# Altium project Capteur_Couleur.PrjPcb
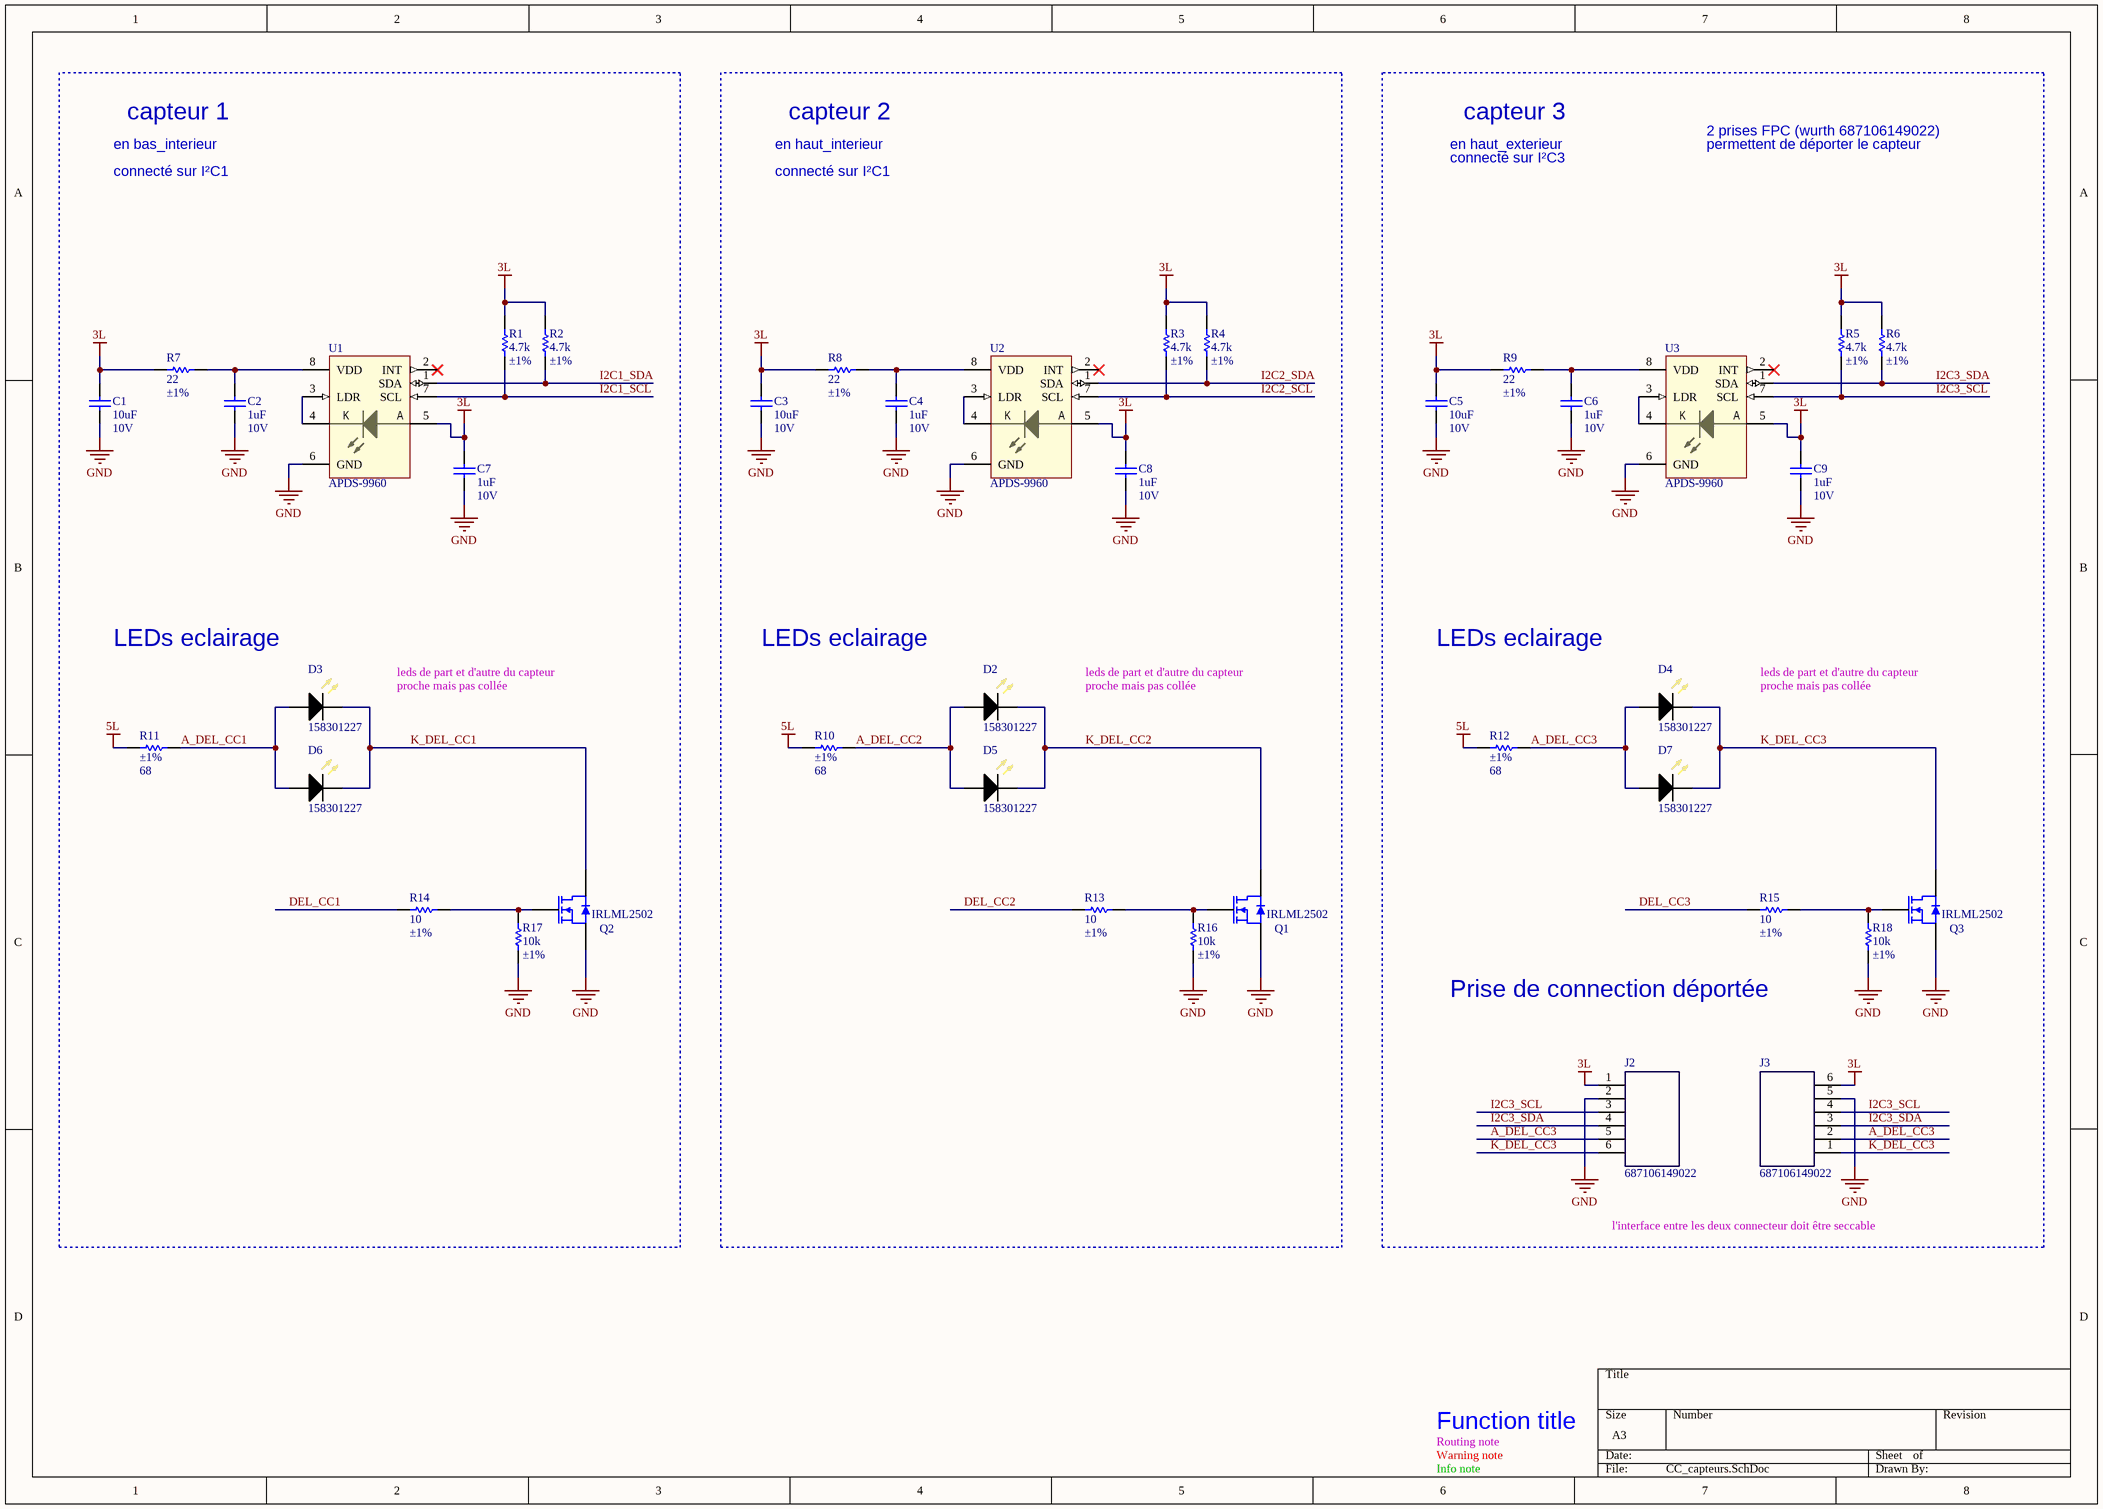
[diagram p0: CC_capteurs.SchDoc]
4 sheets, 89 parts. Net scope: global (net labels, ports and power ports of the same name join across sheets).
Board file: Capteur_Couleur.PcbDoc
Sheets:
  CC_capteurs.SchDoc
  Revision.SchDoc
  CC_pwr-moteur.SchDoc
  CC_microcontroleur.SchDoc

## Sheet CC_capteurs.SchDoc
size A3; Author: Audran; CompanyName: Goldorak; Address1: Electrolab; Address2: 52 rue Paul Lescop; Address3: 92000 Nanterre; ProjectName: Cartes_2017

### Parts
C1  10uF  RatedVoltage: 10V  [WCAP-CSGP_0805, 2x1.25x1.25]
C2  1uF  RatedVoltage: 10V  [WCAP-CSGP_0402, 1x0.5x0.5]
C3  10uF  RatedVoltage: 10V  [WCAP-CSGP_0805, 2x1.25x1.25]
C4  1uF  RatedVoltage: 10V  [WCAP-CSGP_0402, 1x0.5x0.5]
C5  10uF  RatedVoltage: 10V  [WCAP-CSGP_0805, 2x1.25x1.25]
C6  1uF  RatedVoltage: 10V  [WCAP-CSGP_0402, 1x0.5x0.5]
C7  1uF  RatedVoltage: 10V  [WCAP-CSGP_0402, 1x0.5x0.5]
C8  1uF  RatedVoltage: 10V  [WCAP-CSGP_0402, 1x0.5x0.5]
C9  1uF  RatedVoltage: 10V  [WCAP-CSGP_0402, 1x0.5x0.5]
D2  158301227  [WL-SWTP_3014]
D3  158301227  [WL-SWTP_3014]
D4  158301227  [WL-SWTP_3014]
D5  158301227  [WL-SWTP_3014]
D6  158301227  [WL-SWTP_3014]
D7  158301227  [WL-SWTP_3014]
J2  687106149022  [687106149022]
J3  687106149022  [687106149022]
Q1  IRLML2502  [SOT-23]
Q2  IRLML2502  [SOT-23]
Q3  IRLML2502  [SOT-23]
R1  value 4.7k  Precision: ±1%  [RESC1005X04N]
R2  value 4.7k  Precision: ±1%  [RESC1005X04N]
R3  value 4.7k  Precision: ±1%  [RESC1005X04N]
R4  value 4.7k  Precision: ±1%  [RESC1005X04N]
R5  value 4.7k  Precision: ±1%  [RESC1005X04N]
R6  value 4.7k  Precision: ±1%  [RESC1005X04N]
R7  value 22  Precision: ±1%  [RESC1005X04N]
R8  value 22  Precision: ±1%  [RESC1005X04N]
R9  value 22  Precision: ±1%  [RESC1005X04N]
R10  value 68  Precision: ±1%  [RESC1608X06N]  (hidden comment: RC0603FR-0768RL)
R11  value 68  Precision: ±1%  [RESC1608X06N]  (hidden comment: RC0603FR-0768RL)
R12  value 68  Precision: ±1%  [RESC1608X06N]  (hidden comment: RC0603FR-0768RL)
R13  value 10  Precision: ±1%  [RESC1005X04N]  (hidden comment: RC0402FR-0710RL)
R14  value 10  Precision: ±1%  [RESC1005X04N]  (hidden comment: RC0402FR-0710RL)
R15  value 10  Precision: ±1%  [RESC1005X04N]  (hidden comment: RC0402FR-0710RL)
R16  value 10k  Precision: ±1%  [RESC1005X04N]  (hidden comment: RC0402FR-0710KL)
R17  value 10k  Precision: ±1%  [RESC1005X04N]  (hidden comment: RC0402FR-0710KL)
R18  value 10k  Precision: ±1%  [RESC1005X04N]  (hidden comment: RC0402FR-0710KL)
U1  APDS-9960  [APDS996X]
U2  APDS-9960  [APDS996X]
U3  APDS-9960  [APDS996X]

### Nets
3L: C1.2 C3.2 C5.2 C7.2 C8.2 C9.2 J2.1 J3.6 R1.1 R2.1 R3.1 R4.1 R5.1 R6.1 R7.1 R8.1 R9.1 U1.5(LED_A) U2.5(LED_A) U3.5(LED_A)
5L: R10.1 R11.1 R12.1
GND: C1.1 C2.1 C3.1 C4.1 C5.1 C6.1 C7.1 C8.1 C9.1 J2.2 J3.5 Q1.2(S) Q2.2(S) Q3.2(S) R16.1 R17.1 R18.1 U1.6(GND) U2.6(GND) U3.6(GND)
A_DEL_CC1: D3.2(A) D6.2(A) R11.2
A_DEL_CC2: D2.2(A) D5.2(A) R10.2
A_DEL_CC3: D4.2(A) D7.2(A) J2.5 J3.2 R12.2
DEL_CC1: R14.1
DEL_CC2: R13.1
DEL_CC3: R15.1
I2C1_SCL: R1.2 U1.7(SCL)
I2C1_SDA: R2.2 U1.1(SDA)
I2C2_SCL: R3.2 U2.7(SCL)
I2C2_SDA: R4.2 U2.1(SDA)
I2C3_SCL: J2.3 J3.4 R5.2 U3.7(SCL)
I2C3_SDA: J2.4 J3.3 R6.2 U3.1(SDA)
K_DEL_CC1: D3.1(C) D6.1(C) Q2.3(D)
K_DEL_CC2: D2.1(C) D5.1(C) Q1.3(D)
K_DEL_CC3: D4.1(C) D7.1(C) J2.6 J3.1 Q3.3(D)
NetC2_2: C2.2 R7.2 U1.8(VDD)
NetC4_2: C4.2 R8.2 U2.8(VDD)
NetC6_2: C6.2 R9.2 U3.8(VDD)
NetQ1_1: Q1.1(G) R13.2 R16.2
NetQ2_1: Q2.1(G) R14.2 R17.2
NetQ3_1: Q3.1(G) R15.2 R18.2
NetU1_3: U1.3(LDR) U1.4(LED_K)
NetU2_3: U2.3(LDR) U2.4(LED_K)
NetU3_3: U3.3(LDR) U3.4(LED_K)

Not connected (* = marked no-connect by the designer): U1 2(INT)*; U2 2(INT)*; U3 2(INT)*

### Notes on the sheet
- connecté sur I²C1
- en bas_interieur
- capteur 1
- en haut_interieur
- capteur 2
- connecté sur I²C3
- en haut_exterieur
- capteur 3
- 2 prises FPC (wurth 687106149022)
- permettent de déporter le capteur
- LEDs eclairage
- leds de part et d'autre du capteur
- proche mais pas collée
- Prise de connection déportée
- l'interface entre les deux connecteur doit être seccable
- Routing note
- Warning note
- Function title
- Info note
- (in symbol APDS9960) K; A

### Library data of the parts
C1 C3 C5 = WCAP-CSGP, 885012207026: CAP CER 10uF 10V X7R 0805; Manufacturer: Wurth Elektronik; PublishedDate: Aug 2016; ComponentLink1Description: Manufacturer; ComponentLink1URL: http://www.we-online.de; ComponentLink2Description: Datasheet; ComponentLink2URL: http://katalog.we-online.com/pbs/datasheet/885012207026.pdf; Manufacturer Part Number: 885012207026; Value: 10uF; Size: 0805; CeramicType: X7R
C2 C4 C6-C9 = WCAP-CSGP, 885012105012: CAP CER 1UF 10V X5R 0402; Manufacturer: Wurth Elektronik; PublishedDate: Aug 2016; ComponentLink1Description: Manufacturer; ComponentLink1URL: http://www.we-online.de; ComponentLink2Description: Datasheet; ComponentLink2URL: http://katalog.we-online.com/pbs/datasheet/885012105012.pdf; Manufacturer Part Number: 885012105012; Value: 1uF; Size: 0402; CeramicType: X5R
D2-D7 = 158301227: LED WL-SWTP WARM WHT 2700K 1206; Manufacturer: Wurth Electronics Inc.; Supplier 1: Farnell; Supplier Part Number 1: 2470220; Manufacturer Part Number: 158301227; ComponentLink1URL: http://katalog.we-online.de/led/datasheet/158301227.pdf; ComponentLink1Description: Datasheet
J2 J3 = 687106149022: CONN .5MM HORZ BOTTOM SMD 6POS; Manufacturer: Wurth Electronics Inc.; Supplier 1: Farnell; Supplier Part Number 1: 2470697; Manufacturer Part Number: 687106149022; ComponentLink1URL: http://katalog.we-online.de/em/datasheet/6871xx149022.pdf; ComponentLink1Description: Datasheet
Q1-Q3 = IRLML2502: MOSFET CANAL N SOT-23; Manufacturer 1: INTERNATIONAL RECTIFIER; Manufacturer Part Number: IRLML2502PBF; ComponentLink1Description: Datasheet; ComponentLink1URL: http://www.farnell.com/datasheets/1912230.pdf; Supplier 1: Farnell; Supplier Part Number 1: 9102981
R1-R6 = RC0402FR-074K7L: RES SMD 4K7 OHM 1% 1/16W 0402; Manufacturer: Yageo; Power: 63mW; Vmax: 50V; Type: Thick Film; ComponentLink1Description: Manufacturer; ComponentLink1URL: http://www.yageo.com/NewPortal/_en/index.jsp; ComponentLink2Description: Datasheet; ComponentLink2URL: http://www.farnell.com/datasheets/2167052.pdf; Manufacturer Part Number: RC0402FR-074K7L; Supplier 1: Farnell; Supplier Part Number 1: 9239316
R7-R9 = RC0402FR-0722RL: RES SMD 22 OHM 1% 1/16W 0402; Manufacturer: Yageo; Power: 63mW; Vmax: 50V; Type: Thick Film; ComponentLink1Description: Manufacturer; ComponentLink1URL: http://www.yageo.com/NewPortal/_en/index.jsp; ComponentLink2Description: Datasheet; ComponentLink2URL: http://www.farnell.com/datasheets/2167052.pdf; Manufacturer Part Number: RC0402FR-0722RL; Supplier 1: Farnell; Supplier Part Number 1: 9239030
R10-R12 = RC0603FR-0768RL: RES SMD 68 OHM 1% 1/10W 0603; Manufacturer: Yageo; Power: 100mW; Vmax: 50V; Manufacturer Part Number: RC0603FR-0768RL; Type: Thick Film; ComponentLink1Description: Manufacturer; ComponentLink1URL: http://www.yageo.com/NewPortal/_en/index.jsp; ComponentLink2Description: Datasheet; ComponentLink2URL: http://www.farnell.com/datasheets/1868787.pdf; Supplier 1: Farnell; Supplier Part Number 1: 9238344
R13-R15 = RC0402FR-0710RL: RES SMD 10 OHM 1% 1/16W 0402; Manufacturer: Yageo; Power: 63mW; Vmax: 50V; Type: Thick Film; ComponentLink1Description: Manufacturer; ComponentLink1URL: http://www.yageo.com/NewPortal/_en/index.jsp; ComponentLink2Description: Datasheet; ComponentLink2URL: http://www.farnell.com/datasheets/1018594.pdf; Manufacturer Part Number: RC0402FR-0710RL; Supplier 1: Farnell; Supplier Part Number 1: 9238999
R16-R18 = RC0402FR-0710KL: RES SMD 10K OHM 1% 1/16W 0402; Manufacturer: Yageo; Power: 63mW; Vmax: 50V; Type: Thick Film; ComponentLink1Description: Manufacturer; ComponentLink1URL: http://www.yageo.com/NewPortal/_en/index.jsp; ComponentLink2Description: Datasheet; ComponentLink2URL: http://www.farnell.com/datasheets/2167052.pdf; Supplier 1: Farnell; Supplier Part Number 1: 9239359; Manufacturer Part Number: RC0402FR-0710KL
U1-U3 = APDS9960: Digital Proximity, Ambient Light, RGB and Gesture Sensor; Manufacturer: AVAGO TECHNOLOGIES; Manufacturer Part Number: APDS-9960; ComponentLink1URL: http://www.farnell.com/datasheets/1801560.pdf; ComponentLink1Description: Datasheet; Supplier 1: Farnell; Supplier Part Number 1: 2401098

## Sheet Revision.SchDoc
size A4; Author: Audran; CompanyName: Goldorak; Address1: Electrolab; Address2: 52 rue Paul Lescop; Address3: 92000 Nanterre; ProjectName: Cartes_2017
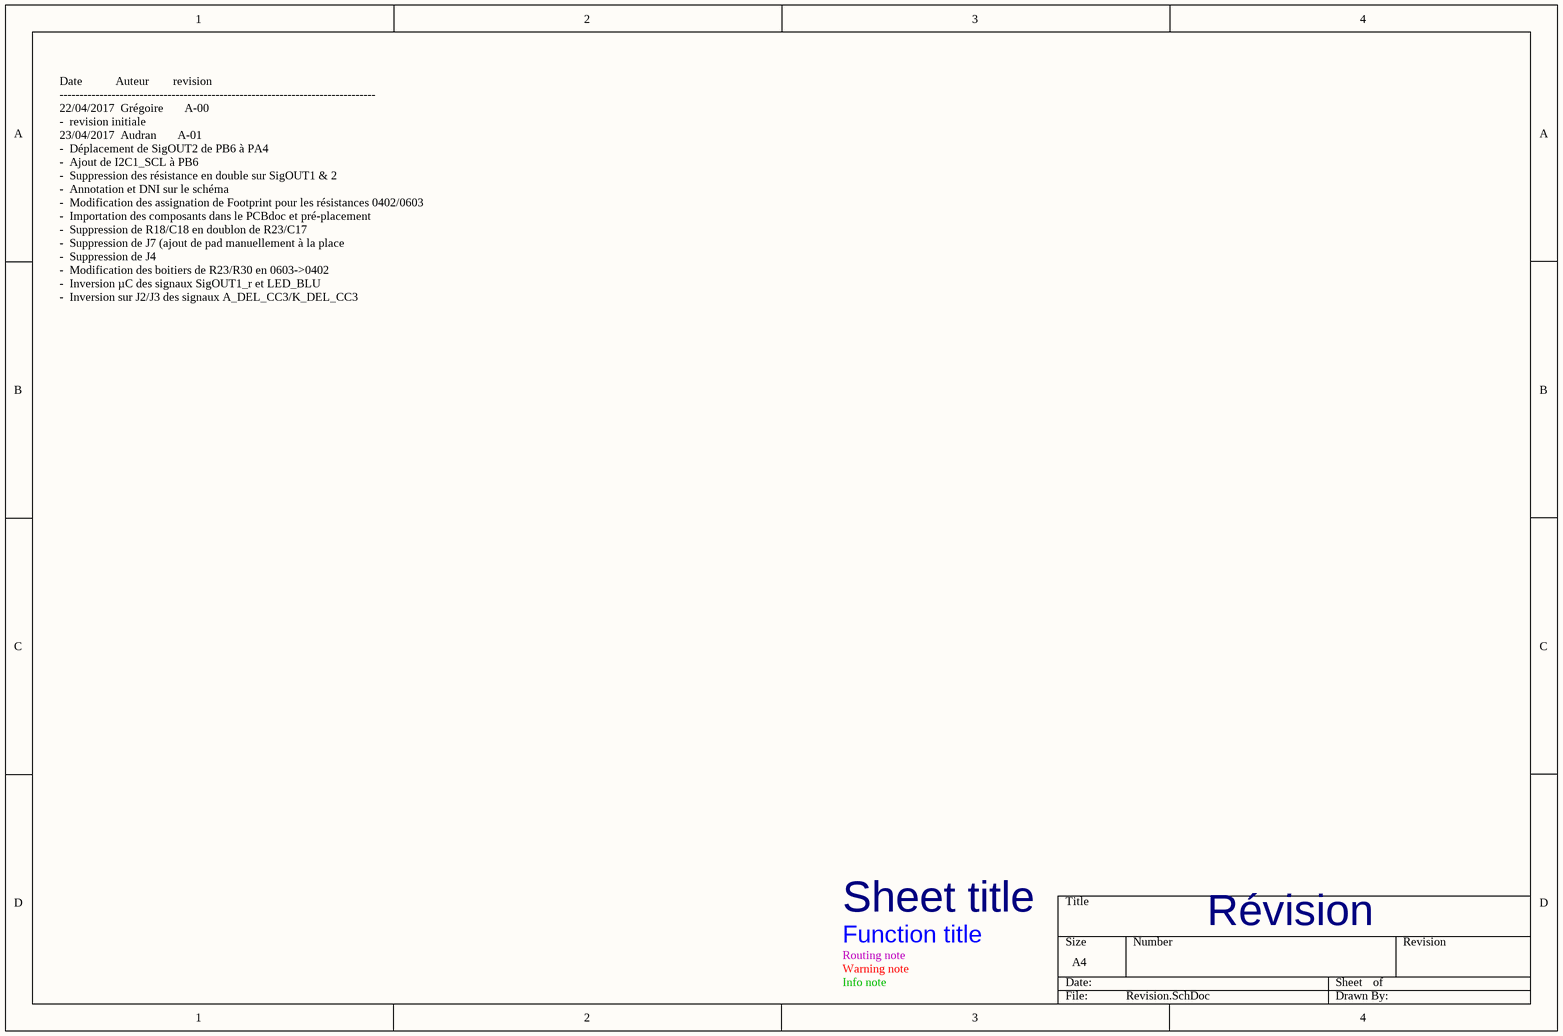
[diagram p1: Revision.SchDoc]

### Notes on the sheet
- Date           Auteur        revision
  -------------------------------------------------------------------------------
  22/04/2017  Grégoire       A-00
  -  revision initiale
  23/04/2017  Audran       A-01
  -  Déplacement de SigOUT2 de PB6 à PA4
  -  Ajout de I2C1_SCL à PB6
  -  Suppression des résistance en double sur SigOUT1 & 2
  -  Annotation et DNI sur le schéma
  -  Modification des assignation de Footprint pour les résistances 0402/0603
  -  Importation des composants dans le PCBdoc et pré-placement
  -  Suppression de R18/C18 en doublon de R23/C17
  -  Suppression de J7 (ajout de pad manuellement à la place
  -  Suppression de J4
  -  Modification des boitiers de R23/R30 en 0603->0402
  -  Inversion µC des signaux SigOUT1_r et LED_BLU
  -  Inversion sur J2/J3 des signaux A_DEL_CC3/K_DEL_CC3
- Sheet title
- Routing note
- Warning note
- Info note
- Function title
- Révision

## Sheet CC_pwr-moteur.SchDoc
size A4; Author: Audran; CompanyName: Goldorak; Address1: Electrolab; Address2: 52 rue Paul Lescop; Address3: 92000 Nanterre; ProjectName: Cartes_2017
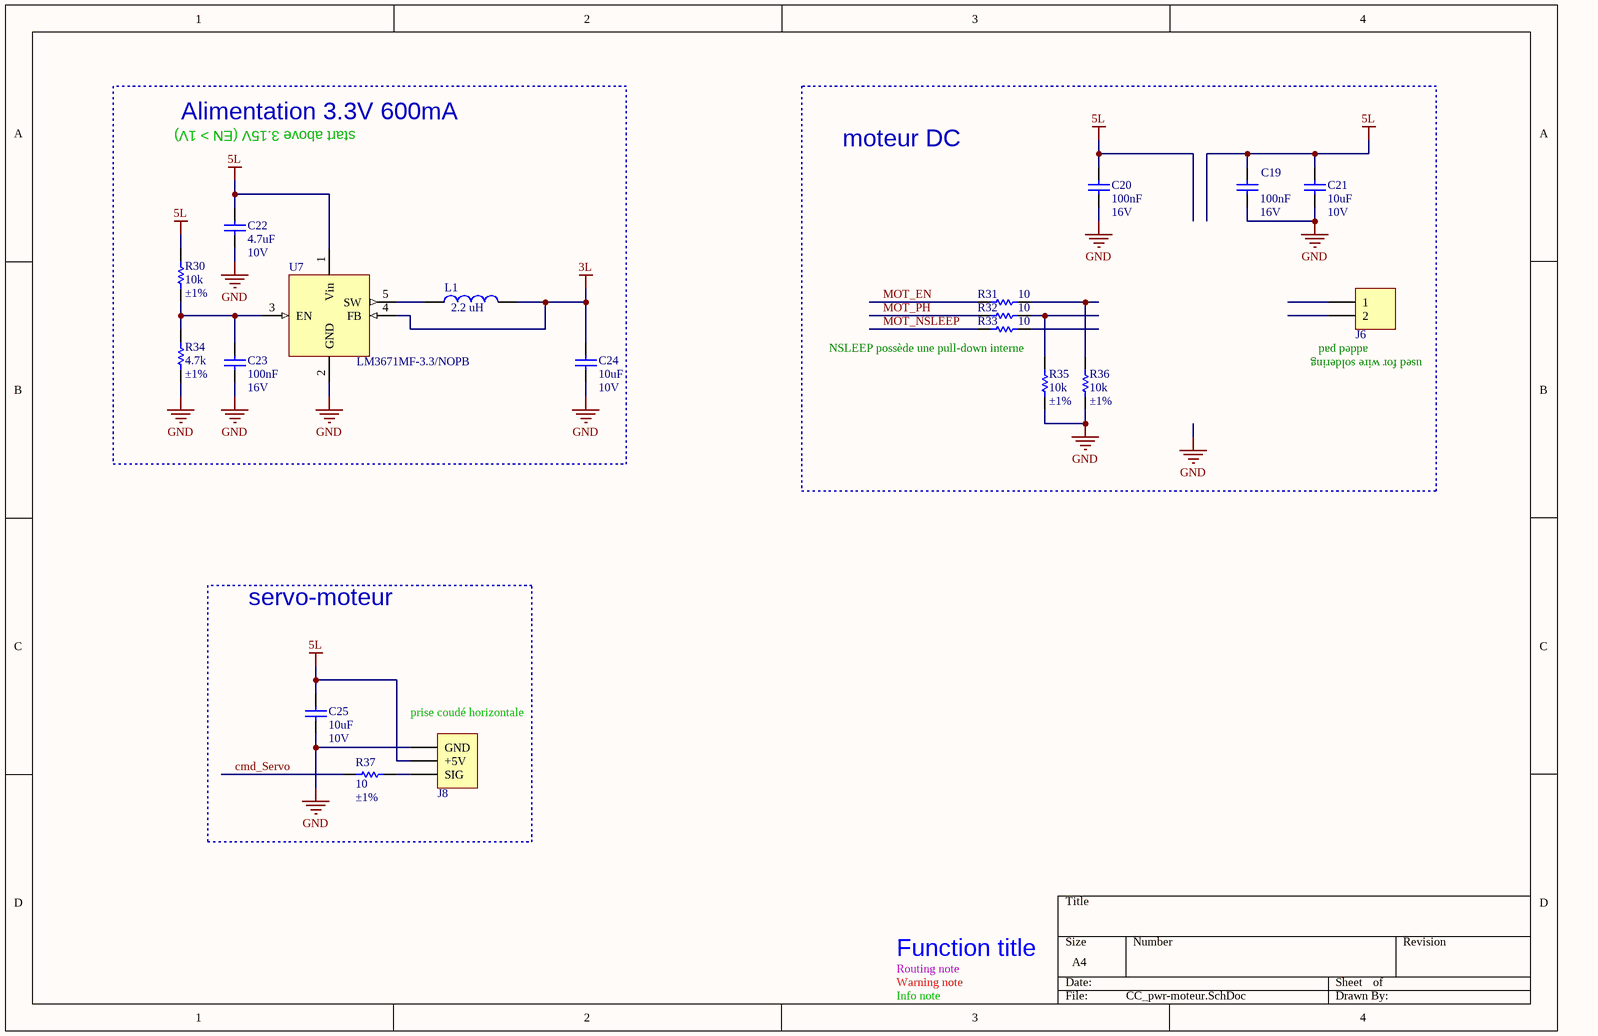
[diagram p2: CC_pwr-moteur.SchDoc]

### Parts
C19  100nF  RatedVoltage: 16V  [WCAP-CSGP_0402, 1x0.5x0.5]
C20  100nF  RatedVoltage: 16V  [WCAP-CSGP_0402, 1x0.5x0.5]
C21  10uF  RatedVoltage: 10V  [WCAP-CSGP_0805, 2x1.25x1.25]
C22  4.7uF  RatedVoltage: 10V  [WCAP-CSGP_0603, 1.6x0.8x0.8]
C23  100nF  RatedVoltage: 16V  [WCAP-CSGP_0402, 1x0.5x0.5]
C24  10uF  RatedVoltage: 10V  [WCAP-CSGP_0805, 2x1.25x1.25]
C25  10uF  RatedVoltage: 10V  [WCAP-CSGP_0805, 2x1.25x1.25]
J6  653102131822  [653102131822]  (value not drawn)
J8  61300311021  [61300311021]  (value not drawn)
L1  value 2.2 uH  [WE-LQS_2010]  (hidden comment: 74404020022)
R30  value 10k  Precision: ±1%  [RESC1005X04N]  (hidden comment: RC0402FR-0710KL)
R31  value 10  [RESC1005X04N]  (hidden comment: RC0402FR-0710RL)
R32  value 10  [RESC1005X04N]  (hidden comment: RC0402FR-0710RL)
R33  value 10  [RESC1005X04N]  (hidden comment: RC0402FR-0710RL)
R34  value 4.7k  Precision: ±1%  [RESC1005X04N]
R35  value 10k  Precision: ±1%  [RESC1005X04N]  (hidden comment: RC0402FR-0710KL)
R36  value 10k  Precision: ±1%  [RESC1005X04N]  (hidden comment: RC0402FR-0710KL)
R37  value 10  Precision: ±1%  [RESC1005X04N]  (hidden comment: RC0402FR-0710RL)
U7  LM3671MF-3.3/NOPB  [SOT23-5]

### Blocks framed on the sheet
Alimentation 3.3V 600mA: C22-C24 L1 R30 R34 U7
moteur DC: C19-C21 J6 R31-R33 R35 R36
servo-moteur: C25 J8 R37

### Nets
3L: C24.2 L1.2 U7.4(FB)
5L: C19.2 C20.2 C21.2 C22.2 C25.2 J8.2(+5V) R30.2 U7.1(Vin)
GND: C19.1 C20.1 C21.1 C22.1 C23.1 C24.1 C25.1 J8.1(GND) R34.1 R35.1 R36.1 U7.2(GND)
cmd_Servo: R37.1
MOT_EN: R31.1
MOT_NSLEEP: R33.1
MOT_PH: R32.1
NetC23_2: C23.2 R30.1 R34.2 U7.3(EN)
NetJ8_3: J8.3(SIG) R37.2
NetL1_1: L1.1 U7.5(SW)
NetR31_2: R31.2 R36.2
NetR32_2: R32.2 R35.2

Not connected (* = marked no-connect by the designer): J6 1 2; R33 2

### Notes on the sheet
- start above 3.15V (EN > 1V)
- NSLEEP possède une pull-down interne
- (near J6) added pad
- (near J6) used for wire soldering
- (near J8) prise coudé horizontale
- Routing note
- Warning note
- Function title
- Info note

### Library data of the parts
C19 C20 C23 = WCAP-CSGP, 885012205037: CAP CER 100nF 16V X7R 0402; Manufacturer: Wurth Elektronik; PublishedDate: Aug 2016; ComponentLink1Description: Manufacturer; ComponentLink1URL: http://www.we-online.de; ComponentLink2Description: Datasheet; ComponentLink2URL: http://katalog.we-online.com/pbs/datasheet/885012205037.pdf; Manufacturer Part Number: 885012205037; Value: 100nF; Size: 0402; CeramicType: X7R
C21 C24 C25 = WCAP-CSGP, 885012207026: as C1 on sheet CC_capteurs; PublishedDate: Aug 2016; ComponentLink1Description: Manufacturer; ComponentLink1URL: http://www.we-online.de; ComponentLink2Description: Datasheet; ComponentLink2URL: http://katalog.we-online.com/pbs/datasheet/885012207026.pdf; Manufacturer Part Number: 885012207026; Value: 10uF; Size: 0805; CeramicType: X7R
C22 = WCAP-CSGP, 885012106012: CAP CER 4.7UF 10V X5R 0603; Manufacturer: Wurth Elektronik; PublishedDate: Aug 2016; ComponentLink1Description: Manufacturer; ComponentLink1URL: http://www.we-online.de; ComponentLink2Description: Datasheet; ComponentLink2URL: http://katalog.we-online.com/pbs/datasheet/885012106012.pdf; Manufacturer Part Number: 885012106012; Value: 4.7uF; Size: 0603; CeramicType: X5R
J6 = 653102131822: WR-WTB 1.25mm; Manufacturer 1: Wuerth Elektronik; ComponentLink1 Description: Manufacturer; ComponentLink2 Description: Datasheet; Value: 2; ComponentLink1URL: http://www.we-online.com; ComponentLink2URL: http://katalog.we-online.de/em/datasheet/6531xx131822.pdf; Manufacturer Part Number: 653102131822; Supplier 1: farnell; Supplier Part Number 1: 1841413
J8 = 61300311021: CONN HEADER 3 POS RA 2.54mm; Manufacturer: Wurth Electronics Inc.; Supplier 1: Farnell; Supplier Part Number 1: 2356177; Manufacturer Part Number: 61300311021; ComponentLink1URL: http://katalog.we-online.de/em/datasheet/6130xx11021.pdf; ComponentLink1Description: Datasheet
L1 = 74404020022: FIXED IND 2.2UH 960MA 220 MOHM; Manufacturer: Wurth Elektronik; RatedCurrent: 0.96 A; PublishedDate: Nov. 2016; ComponentLink1Description: Manufacturer; ComponentLink1URL: http://www.we-online.de; ComponentLink2Description: Datasheet; ComponentLink2URL: http://katalog.we-online.de/pbs/datasheet/74404020022.pdf; Manufacturer Part Number: 74404020022; Size: 2010
R30 R35 R36 = RC0402FR-0710KL: as R16 on sheet CC_capteurs; Type: Thick Film; ComponentLink1Description: Manufacturer; ComponentLink1URL: http://www.yageo.com/NewPortal/_en/index.jsp; ComponentLink2Description: Datasheet; ComponentLink2URL: http://www.farnell.com/datasheets/2167052.pdf; Supplier 1: Farnell; Supplier Part Number 1: 9239359; Manufacturer Part Number: RC0402FR-0710KL
R31-R33 R37 = RC0402FR-0710RL: as R13 on sheet CC_capteurs; Type: Thick Film; ComponentLink1Description: Manufacturer; ComponentLink1URL: http://www.yageo.com/NewPortal/_en/index.jsp; ComponentLink2Description: Datasheet; ComponentLink2URL: http://www.farnell.com/datasheets/1018594.pdf; Manufacturer Part Number: RC0402FR-0710RL; Supplier 1: Farnell; Supplier Part Number 1: 9238999
  R31-R33: Precision: ±1%
R34 = RC0402FR-074K7L: as R1 on sheet CC_capteurs; Type: Thick Film; ComponentLink1Description: Manufacturer; ComponentLink1URL: http://www.yageo.com/NewPortal/_en/index.jsp; ComponentLink2Description: Datasheet; ComponentLink2URL: http://www.farnell.com/datasheets/2167052.pdf; Manufacturer Part Number: RC0402FR-074K7L; Supplier 1: Farnell; Supplier Part Number 1: 9239316
U7 = LM3671MF-3.3/NOPB: IC REG BUCK 3.3V 0.6A SYNC SOT23; Manufacturer: Texas Instruments; Supplier 1: Farnell; Supplier Part Number 1: 1685767; Manufacturer Part Number: LM3671MF-3.3/NOPB; ComponentLink1URL: http://www.ti.com/lit/ds/symlink/lm3671.pdf; ComponentLink1Description: Datasheet

## Sheet CC_microcontroleur.SchDoc
size A3; Author: Audran; CompanyName: Goldorak; Address1: Electrolab; Address2: 52 rue Paul Lescop; Address3: 92000 Nanterre; ProjectName: Cartes_2017
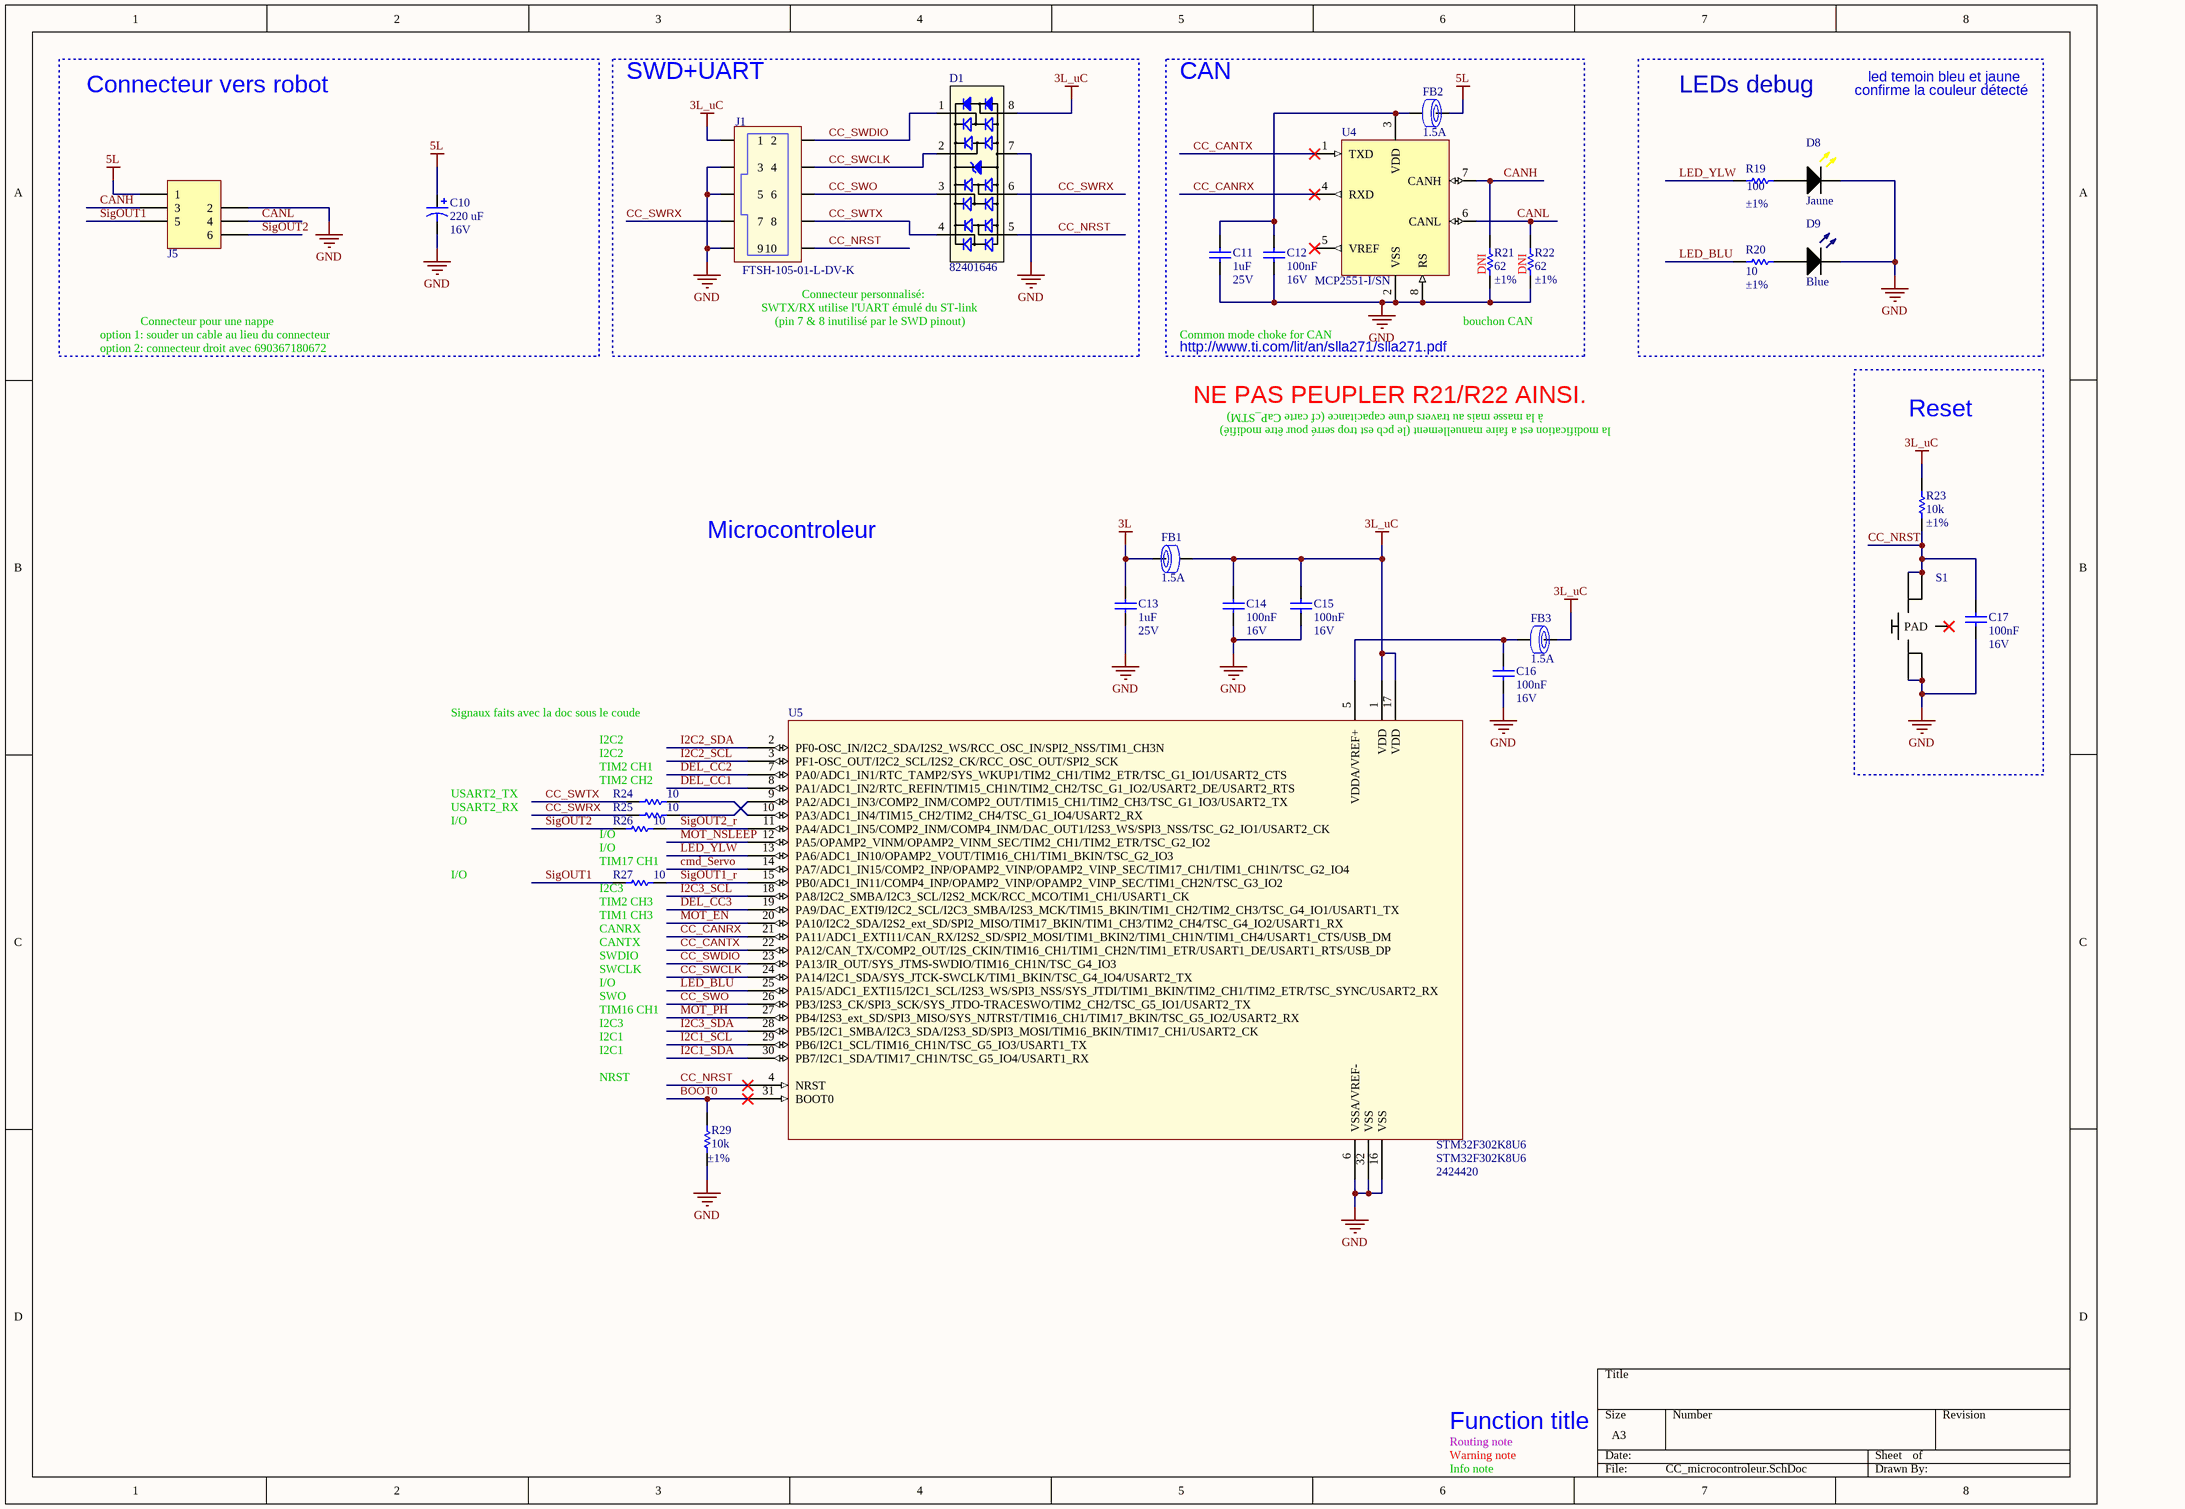
[diagram p3: CC_microcontroleur.SchDoc]

### Parts
C10  220 uF  RatedVoltage: 16V  [WCAP-ATG8_6.3x11x2.5x0.5]
C11  1uF  RatedVoltage: 25V  [WCAP-CSGP_0603, 1.6x0.8x0.8]
C12  100nF  RatedVoltage: 16V  [WCAP-CSGP_0402, 1x0.5x0.5]
C13  1uF  RatedVoltage: 25V  [WCAP-CSGP_0603, 1.6x0.8x0.8]
C14  100nF  RatedVoltage: 16V  [WCAP-CSGP_0402, 1x0.5x0.5]
C15  100nF  RatedVoltage: 16V  [WCAP-CSGP_0402, 1x0.5x0.5]
C16  100nF  RatedVoltage: 16V  [WCAP-CSGP_0402, 1x0.5x0.5]
C17  100nF  RatedVoltage: 16V  [WCAP-CSGP_0402, 1x0.5x0.5]
D1  82401646  [MSOP-8L]
D8  Jaune  [0603]
D9  Blue  [0603]
FB1  RatedCurrent: 1.5A  [WE-CBF_0603_High Current]  (hidden comment: 742792624)
FB2  RatedCurrent: 1.5A  [WE-CBF_0603_High Current]  (hidden comment: 742792624)
FB3  RatedCurrent: 1.5A  [WE-CBF_0603_High Current]  (hidden comment: 742792624)
J1  FTSH-105-01-L-DV-K  [FTSH-105-01-L-DV-K]
J5  690368170672  [690368170672]  (value not drawn)
R19  value 100  Precision: ±1%  [RESC1005X04N]  (hidden comment: RC0402FR-07100RL)
R20  value 10  Precision: ±1%  [RESC1005X04N]  (hidden comment: RC0402FR-0710RL)
R21  value 62  Precision: ±1%  [RESC1005X04N]  (hidden comment: RC0402FR-0762RL)
R22  value 62  Precision: ±1%  [RESC1005X04N]  (hidden comment: RC0402FR-0762RL)
R23  value 10k  Precision: ±1%  [RESC1005X04N]  (hidden comment: RC0402FR-0710KL)
R24  value 10  [RESC1005X04N]  (hidden comment: RC0402FR-0710RL)
R25  value 10  [RESC1005X04N]  (hidden comment: RC0402FR-0710RL)
R26  value 10  [RESC1005X04N]  (hidden comment: RC0402FR-0710RL)
R27  value 10  [RESC1005X04N]  (hidden comment: RC0402FR-0710RL)
R29  value 10k  Precision: ±1%  [RESC1005X04N]  (hidden comment: RC0402FR-0710KL)
S1  MCITPG  [MCIPTG23K-V]  (value not drawn)
U4  MCP2551-I/SN  [SO8_N]
U5  STM32F302K8U6  Supplier Part Number 1: 2424420  [QFN50P500X500X60_HS-33N]

### Blocks framed on the sheet
Connecteur vers robot: C10 J5
SWD+UART: D1 J1
CAN: C11 C12 FB2 R21 R22 U4
LEDs debug: D8 D9 R19 R20
Reset: C17 R23 S1

### Nets
3L: C13.2 FB1.1
3L_uC: C14.2 C15.2 D1.8 FB1.2 FB3.1 J1.1 R23.2 U5.1(VDD) U5.17(VDD)
5L: C10.1 FB2.1 J5.1
GND: C10.2 C11.1 C12.1 C13.1 C14.1 C15.1 C16.1 C17.1 D1.7 D8.1(C) D9.1(C) J1.3 J1.5 J1.9 J5.2 R21.1 R22.1 R29.1 S1.1 S1.3 U4.2(VSS) U4.8(RS) U5.6(VSSA/VREF-) U5.16(VSS) U5.32(VSS)
BOOT0: R29.2 U5.31(BOOT0)
CANH: J5.3 R21.2 U4.7(CANH)
CANL: J5.4 R22.2 U4.6(CANL)
CC_CANRX: U4.4(RXD) U5.21(PA11/ADC1_EXTI11/CAN_RX/I2S2_SD/SPI2_MOSI/TIM1_BKIN2/TIM1_CH1N/TIM1_CH4/USART1_CTS/USB_DM)
CC_CANTX: U4.1(TXD) U5.22(PA12/CAN_TX/COMP2_OUT/I2S_CKIN/TIM16_CH1/TIM1_CH2N/TIM1_ETR/USART1_DE/USART1_RTS/USB_DP)
CC_NRST: C17.2 D1.5 J1.10 R23.1 S1.2 S1.4 U5.4(NRST)
CC_SWCLK: D1.2 J1.4 U5.24(PA14/I2C1_SDA/SYS_JTCK-SWCLK/TIM1_BKIN/TSC_G4_IO4/USART2_TX)
CC_SWDIO: D1.1 J1.2 U5.23(PA13/IR_OUT/SYS_JTMS-SWDIO/TIM16_CH1N/TSC_G4_IO3)
CC_SWO: D1.3 J1.6 U5.26(PB3/I2S3_CK/SPI3_SCK/SYS_JTDO-TRACESWO/TIM2_CH2/TSC_G5_IO1/USART2_TX)
CC_SWRX: D1.6 J1.7 R25.1
CC_SWTX: D1.4 J1.8 R24.1
cmd_Servo: U5.14(PA7/ADC1_IN15/COMP2_INP/OPAMP2_VINP/OPAMP2_VINP_SEC/TIM17_CH1/TIM1_CH1N/TSC_G2_IO4)
DEL_CC1: U5.8(PA1/ADC1_IN2/RTC_REFIN/TIM15_CH1N/TIM2_CH2/TSC_G1_IO2/USART2_DE/USART2_RTS)
DEL_CC2: U5.7(PA0/ADC1_IN1/RTC_TAMP2/SYS_WKUP1/TIM2_CH1/TIM2_ETR/TSC_G1_IO1/USART2_CTS)
DEL_CC3: U5.19(PA9/DAC_EXTI9/I2C2_SCL/I2C3_SMBA/I2S3_MCK/TIM15_BKIN/TIM1_CH2/TIM2_CH3/TSC_G4_IO1/USART1_TX)
I2C1_SCL: U5.29(PB6/I2C1_SCL/TIM16_CH1N/TSC_G5_IO3/USART1_TX)
I2C1_SDA: U5.30(PB7/I2C1_SDA/TIM17_CH1N/TSC_G5_IO4/USART1_RX)
I2C2_SCL: U5.3(PF1-OSC_OUT/I2C2_SCL/I2S2_CK/RCC_OSC_OUT/SPI2_SCK)
I2C2_SDA: U5.2(PF0-OSC_IN/I2C2_SDA/I2S2_WS/RCC_OSC_IN/SPI2_NSS/TIM1_CH3N)
I2C3_SCL: U5.18(PA8/I2C2_SMBA/I2C3_SCL/I2S2_MCK/RCC_MCO/TIM1_CH1/USART1_CK)
I2C3_SDA: U5.28(PB5/I2C1_SMBA/I2C3_SDA/I2S3_SD/SPI3_MOSI/TIM16_BKIN/TIM17_CH1/USART2_CK)
LED_BLU: R20.1 U5.25(PA15/ADC1_EXTI15/I2C1_SCL/I2S3_WS/SPI3_NSS/SYS_JTDI/TIM1_BKIN/TIM2_CH1/TIM2_ETR/TSC_SYNC/USART2_RX)
LED_YLW: R19.1 U5.13(PA6/ADC1_IN10/OPAMP2_VOUT/TIM16_CH1/TIM1_BKIN/TSC_G2_IO3)
MOT_EN: U5.20(PA10/I2C2_SDA/I2S2_ext_SD/SPI2_MISO/TIM17_BKIN/TIM1_CH3/TIM2_CH4/TSC_G4_IO2/USART1_RX)
MOT_NSLEEP: U5.12(PA5/OPAMP2_VINM/OPAMP2_VINM_SEC/TIM2_CH1/TIM2_ETR/TSC_G2_IO2)
MOT_PH: U5.27(PB4/I2S3_ext_SD/SPI3_MISO/SYS_NJTRST/TIM16_CH1/TIM17_BKIN/TSC_G5_IO2/USART2_RX)
SigOUT1: J5.5 R27.1
SigOUT1_r: R27.2 U5.15(PB0/ADC1_IN11/COMP4_INP/OPAMP2_VINP/OPAMP2_VINP_SEC/TIM1_CH2N/TSC_G3_IO2)
SigOUT2: J5.6 R26.1
SigOUT2_r: R26.2 U5.11(PA4/ADC1_IN5/COMP2_INM/COMP4_INM/DAC_OUT1/I2S3_WS/SPI3_NSS/TSC_G2_IO1/USART2_CK)
NetC11_2: C11.2 C12.2 FB2.2 U4.3(VDD)
NetC16_2: C16.2 FB3.2 U5.5(VDDA/VREF+)
NetD8_2: D8.2(A) R19.2
NetD9_2: D9.2(A) R20.2
NetR24_2: R24.2 U5.10(PA3/ADC1_IN4/TIM15_CH2/TIM2_CH4/TSC_G1_IO4/USART2_RX)
NetR25_2: R25.2 U5.9(PA2/ADC1_IN3/COMP2_INM/COMP2_OUT/TIM15_CH1/TIM2_CH3/TSC_G1_IO3/USART2_TX)

Not connected (* = marked no-connect by the designer): S1 5(PAD)*; U4 5(VREF)*

### Notes on the sheet
- confirme la couleur détecté
- led temoin bleu et jaune
- SWTX/RX utilise l'UART émulé du ST-link
- Connecteur personnalisé:
- (near R21) DNI
- (near R22) DNI
- option 1: souder un cable au lieu du connecteur
- option 2: connecteur droit avec 690367180672
- Connecteur pour une nappe
- (pin 7 & 8 inutilisé par le SWD pinout)
- http://www.ti.com/lit/an/slla271/slla271.pdf
- Common mode choke for CAN
- bouchon CAN
- NE PAS PEUPLER R21/R22 AINSI.
- à la masse mais au travers d'une capacitance (cf carte CaP_STM)
- la modification est a faire manuellement (le pcb est trop serré pour être modifié)
- Microcontroleur
- Signaux faits avec la doc sous le coude
- I2C2
- TIM2 CH1
- (near R24) TIM2 CH2
- USART2_TX
- USART2_RX
- I/O
- (near R26) I/O
- (near R27) TIM2 CH3
- (near R27) TIM17 CH1
- (near R27) I2C3
- (near R27) TIM1 CH3
- (near R27) CANRX
- CANTX
- SWDIO
- SWCLK
- SWO
- TIM16 CH1
- I2C3
- I2C1
- NRST
- Routing note
- Warning note
- Function title
- Info note

### Library data of the parts
C10 = WCAP-ATG8, 860010373010: CAP Alu 220 UF 20% 16 V; Manufacturer: Wurth Elektronik; PublishedDate: July 2016; ComponentLink1Description: Manufacturer; ComponentLink1URL: http://www.we-online.de; ComponentLink2Description: Datasheet; ComponentLink2URL: http://katalog.we-online.de/pbs/datasheet/860010373010.pdf; Manufacturer Part Number: 860010373010; Value: 220 uF; Size: 6.3mmx11mm
C11 C13 = WCAP-CSGP, 885012206076: CAP CER 1uF 25V X7R 0603; Manufacturer: Wurth Elektronik; PublishedDate: Aug 2016; ComponentLink1Description: Manufacturer; ComponentLink1URL: http://www.we-online.de; ComponentLink2Description: Datasheet; ComponentLink2URL: http://katalog.we-online.com/pbs/datasheet/885012206076.pdf; Manufacturer Part Number: 885012206076; Value: 1uF; Size: 0603; CeramicType: X7R
C12 C14-C17 = WCAP-CSGP, 885012205037: as C19 on sheet CC_pwr-moteur; PublishedDate: Aug 2016; ComponentLink1Description: Manufacturer; ComponentLink1URL: http://www.we-online.de; ComponentLink2Description: Datasheet; ComponentLink2URL: http://katalog.we-online.com/pbs/datasheet/885012205037.pdf; Value: 100nF; Size: 0402; CeramicType: X7R; Manufacturer Part Number: 885012205037
D1 = 82401646: TVS DIODE 5VWM 13VC 8MSOP; Manufacturer: Wurth Electronics Inc.; Supplier 1: Farnell; Manufacturer Part Number: 82401646; ComponentLink1URL: http://katalog.we-online.de/pbs/datasheet/82401646.pdf; ComponentLink1Description: Datasheet; Supplier Part Number 1: 1825864
D8 = WL-SMCW 0603  150060YS75000: SMD mono-color Chip LED, WL-SMCW, Yellow; Manufacturer 1: Würth Elektronik eiSos GmbH; Manufacturer Part Number: 150060YS75000; ComponentLink1Description: Manufacturer; ComponentLink1URL: http://www.we-online.de; Created by: Christin Otto; Created Date: June 2013; ComponentLink2Description: Datasheet; ComponentLink2URL: http://katalog.we-online.com/led/datasheet/150060YS75000.pdf; Color: Yellow; Value: Jaune; Supplier 1: Farnell; Supplier Part Number 1: 2322074
D9 = WL-SMCW 0603  150060BS75000: SMD mono-color Chip LED, WL-SMCW, Blue; Manufacturer 1: Würth Elektronik eiSos GmbH; Manufacturer Part Number: 150060BS75000; ComponentLink1Description: Manufacturer; ComponentLink1URL: http://www.we-online.de; Created by: Christin Otto; Created Date: June 2013; ComponentLink2Description: Datasheet; ComponentLink2URL: http://katalog.we-online.com/led/datasheet/150060BS75000.pdf; Color: Blue; Value: Blue; Supplier 1: Farnell; Supplier Part Number 1: 2322069
FB1-FB3 = WE-CBF, 742792624: Ferrite Bead 180ohm 0603 max1.5A; Manufacturer: Wurth Elektronik; Value: 180Ω; Type: High Current; PublishedDate: Aug 2016; ComponentLink1Description: Manufacturer; ComponentLink1URL: http://www.we-online.de; ComponentLink2Description: Datasheet; ComponentLink2URL: http://katalog.we-online.de/pbs/datasheet/742792624.pdf; Manufacturer Part Number: 742792624; Size: 0603
J1 = FTSH-105-01-L-DV-K: CONN HEADER 10 POS DUAL .05" SMD with Keying; Manufacturer: Samtec Inc.; Supplier 1: Digi-Key; Manufacturer Part Number: FTSH-105-01-L-DV-K; ComponentLink1URL: http://suddendocs.samtec.com/prints/ftsh-1xx-xx-xxx-dv-xxx-xxx-mkt.pdf; ComponentLink1Description: Datasheet; Supplier Part Number 1: SAM8799-ND
J5 = 690368170672: WR-MM 6p Female Angled TH Connector with Polarization; Manufacturer: Wurth Electronics Inc.; Value: 6; Manufacturer Part Number: 690368170672; ComponentLink1URL: http://www.we-online.com; ComponentLink1Description: Manufacturer; ComponentLink2URL: http://katalog.we-online.de/em/datasheet/69035710xx72.pdf; ComponentLink2Description: Datasheet; Supplier 1: Farnell; Supplier Part Number 1: 1641862
R19 = RC0402FR-07100RL: RES SMD 100 OHM 1% 1/16W 0402; Manufacturer: Yageo; Power: 63mW; Vmax: 50V; Type: Thick Film; ComponentLink1Description: Manufacturer; ComponentLink1URL: http://www.yageo.com/NewPortal/_en/index.jsp; ComponentLink2Description: Datasheet; ComponentLink2URL: http://www.farnell.com/datasheets/2167052.pdf; Manufacturer Part Number: RC0402FR-07100RL; Supplier 1: Farnell; Supplier Part Number 1: 9239111
R20 R24-R27 = RC0402FR-0710RL: as R13 on sheet CC_capteurs; Type: Thick Film; ComponentLink1Description: Manufacturer; ComponentLink1URL: http://www.yageo.com/NewPortal/_en/index.jsp; ComponentLink2Description: Datasheet; ComponentLink2URL: http://www.farnell.com/datasheets/1018594.pdf; Manufacturer Part Number: RC0402FR-0710RL; Supplier 1: Farnell; Supplier Part Number 1: 9238999
  R24-R27: Precision: ±1%
R21 R22 = RC0402FR-0762RL: RES SMD 62 OHM 1% 1/16W 0402; Manufacturer: Yageo; Power: 63mW; Vmax: 50V; Type: Thick Film; ComponentLink1Description: Manufacturer; ComponentLink1URL: http://www.yageo.com/NewPortal/_en/index.jsp; ComponentLink2Description: Datasheet; ComponentLink2URL: http://www.farnell.com/datasheets/2167052.pdf; Manufacturer Part Number: RC0402FR-0762RL; Supplier 1: Farnell; Supplier Part Number 1: 1458813
R23 R29 = RC0402FR-0710KL: as R16 on sheet CC_capteurs; Type: Thick Film; ComponentLink1Description: Manufacturer; ComponentLink1URL: http://www.yageo.com/NewPortal/_en/index.jsp; ComponentLink2Description: Datasheet; ComponentLink2URL: http://www.farnell.com/datasheets/2167052.pdf; Supplier 1: Farnell; Supplier Part Number 1: 9239359; Manufacturer Part Number: RC0402FR-0710KL
S1 = MCIPTG23K-V: Switch MCIPTG23K-V Multicomp; Supplier 1: Farnell; Supplier Part Number 1: 1605470; Manufacturer: MULTICOMP; Manufacturer Part Number: MCIPTG23K-V; Pricing: 1=0.7, 50=0.65, 100=0.61, 500=0.57, 1000=0.53, 7000=0.37, 7000=0.333, 30000=0.3 (EUR); ComponentLink1URL: http://www.farnell.com/cad/1662547.pdf; ComponentLink1Description: http://www.farnell.com/cad/1662547.pdf
U4 = MCP2551-I/SN: IC TRANSCEIVER CAN HI-SPD 8-SOIC; Manufacturer: Microchip Technology; Manufacturer Part Number: MCP2551-I/SN; ComponentLink1Description: Datasheet; ComponentLink1URL: http://www.farnell.com/datasheets/657417.pdf; Supplier 1: Farnell; Supplier Part Number 1: 9758569
U5 = STM32F302K8U6: Manufacturer: STMICROELECTRONICS; Pricing: 1=0.5, 25=0.4, 100=0.33, 250=0.27, 500=0.228, 2000=0.16, 2000=0.157, 20000=0.154 (EUR); Supplier 1: Farnell; Manufacturer Part Number: STM32F302K8U6

## Nets that join several sheets
3L: CC_capteurs (20 pins), CC_pwr-moteur (C24.2 L1.2 U7.4), CC_microcontroleur (C13.2 FB1.1)
5L: CC_capteurs (R10.1 R11.1 R12.1), CC_pwr-moteur (8 pins), CC_microcontroleur (C10.1 FB2.1 J5.1)
GND: CC_capteurs (20 pins), CC_pwr-moteur (12 pins), CC_microcontroleur (25 pins)
cmd_Servo: CC_pwr-moteur (R37.1), CC_microcontroleur (U5.14)
DEL_CC1: CC_capteurs (R14.1), CC_microcontroleur (U5.8)
DEL_CC2: CC_capteurs (R13.1), CC_microcontroleur (U5.7)
DEL_CC3: CC_capteurs (R15.1), CC_microcontroleur (U5.19)
I2C1_SCL: CC_capteurs (R1.2 U1.7), CC_microcontroleur (U5.29)
I2C1_SDA: CC_capteurs (R2.2 U1.1), CC_microcontroleur (U5.30)
I2C2_SCL: CC_capteurs (R3.2 U2.7), CC_microcontroleur (U5.3)
I2C2_SDA: CC_capteurs (R4.2 U2.1), CC_microcontroleur (U5.2)
I2C3_SCL: CC_capteurs (J2.3 J3.4 R5.2 U3.7), CC_microcontroleur (U5.18)
I2C3_SDA: CC_capteurs (J2.4 J3.3 R6.2 U3.1), CC_microcontroleur (U5.28)
MOT_EN: CC_pwr-moteur (R31.1), CC_microcontroleur (U5.20)
MOT_NSLEEP: CC_pwr-moteur (R33.1), CC_microcontroleur (U5.12)
MOT_PH: CC_pwr-moteur (R32.1), CC_microcontroleur (U5.27)

## Assembly variants
Prod2017: not fitted J2 J3 J4 J7